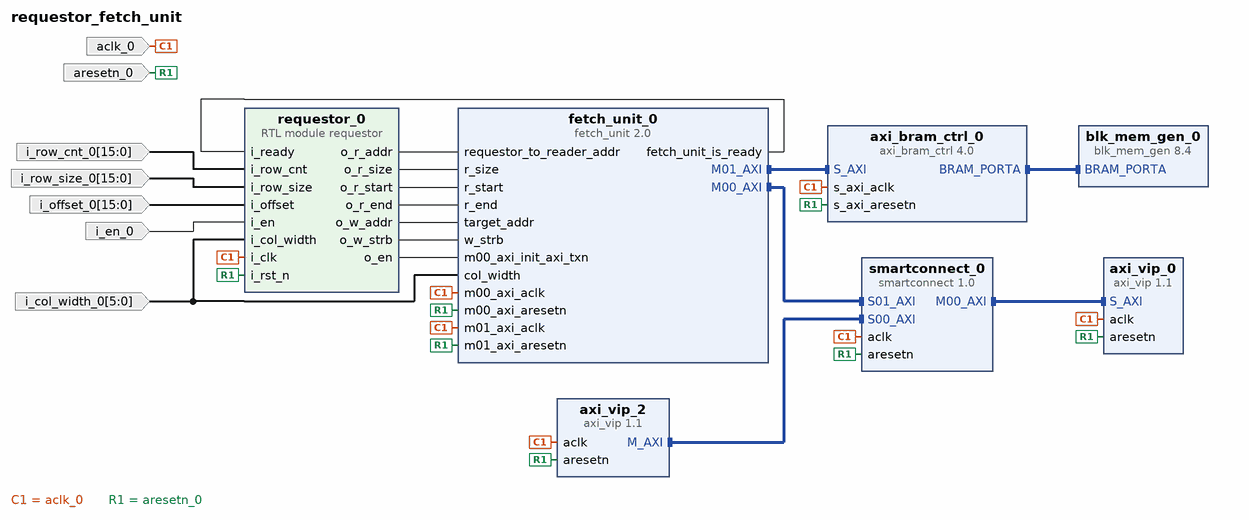
[diagram p0: block diagram of the top level]
# Vivado block design requestor_fetch_unit, xczu9eg-ffvb1156-2-e, Vivado 2017.4
create_bd_design requestor_fetch_unit

create_bd_port -dir I -type clk aclk_0
create_bd_port -dir I -type rst aresetn_0
create_bd_port -dir I -from 15 -to 0 i_row_cnt_0
create_bd_port -dir I -from 15 -to 0 i_row_size_0
create_bd_port -dir I -from 15 -to 0 i_offset_0
create_bd_port -dir I i_en_0
create_bd_port -dir I -from 5 -to 0 i_col_width_0

create_bd_cell -type ip -vlnv xilinx.com:ip:axi_vip:1.1 axi_vip_0
set_property -dict {CONFIG.INTERFACE_MODE SLAVE CONFIG.DATA_WIDTH 128} [get_bd_cells axi_vip_0]
create_bd_cell -type ip -vlnv xilinx.com:ip:axi_vip:1.1 axi_vip_2
set_property -dict [list \
  CONFIG.PROTOCOL AXI4 \
  CONFIG.READ_WRITE_MODE READ_WRITE \
  CONFIG.INTERFACE_MODE MASTER \
  CONFIG.ADDR_WIDTH 32 \
  CONFIG.DATA_WIDTH 128 \
  CONFIG.ID_WIDTH 0 \
  CONFIG.AWUSER_WIDTH 0 \
  CONFIG.ARUSER_WIDTH 0 \
  CONFIG.RUSER_WIDTH 0 \
  CONFIG.WUSER_WIDTH 0 \
  CONFIG.BUSER_WIDTH 0 \
  CONFIG.WUSER_BITS_PER_BYTE 0 \
  CONFIG.RUSER_BITS_PER_BYTE 0 \
  CONFIG.SUPPORTS_NARROW 1 \
  CONFIG.HAS_BURST 1 \
  CONFIG.HAS_LOCK 1 \
  CONFIG.HAS_CACHE 1 \
  CONFIG.HAS_REGION 1 \
  CONFIG.HAS_QOS 1 \
  CONFIG.HAS_PROT 1 \
  CONFIG.HAS_WSTRB 1 \
  CONFIG.HAS_BRESP 1 \
  CONFIG.HAS_RRESP 1 \
] [get_bd_cells axi_vip_2]
create_bd_cell -type ip -vlnv xilinx.com:ip:smartconnect:1.0 smartconnect_0
create_bd_cell -type ip -vlnv xilinx.com:ip:axi_bram_ctrl:4.0 axi_bram_ctrl_0
set_property -dict {CONFIG.DATA_WIDTH 128 CONFIG.SINGLE_PORT_BRAM 1} [get_bd_cells axi_bram_ctrl_0]
create_bd_cell -type ip -vlnv xilinx.com:ip:blk_mem_gen:8.4 blk_mem_gen_0
set_property -dict [list \
  CONFIG.Enable_32bit_Address true \
  CONFIG.Write_Width_A 128 \
  CONFIG.Read_Width_A 128 \
  CONFIG.Register_PortA_Output_of_Memory_Primitives false \
  CONFIG.Use_RSTA_Pin true \
  CONFIG.use_bram_block BRAM_Controller \
  CONFIG.EN_SAFETY_CKT true \
] [get_bd_cells blk_mem_gen_0]
create_bd_cell -type ip -vlnv user.org:user:fetch_unit:2.0 fetch_unit_0
set_property -dict {CONFIG.C_M01_AXI_BURST_LEN 1 CONFIG.C_M00_AXI_BURST_LEN 4 CONFIG.BUS_BIT 7} [get_bd_cells fetch_unit_0]
create_bd_cell -type module -reference requestor requestor_0

# ---- connections ----

connect_bd_intf_net [get_bd_intf_pins smartconnect_0/S00_AXI] [get_bd_intf_pins axi_vip_2/M_AXI]
connect_bd_intf_net [get_bd_intf_pins smartconnect_0/S01_AXI] [get_bd_intf_pins fetch_unit_0/M00_AXI]
connect_bd_intf_net [get_bd_intf_pins axi_vip_0/S_AXI] [get_bd_intf_pins smartconnect_0/M00_AXI]
connect_bd_intf_net [get_bd_intf_pins fetch_unit_0/M01_AXI] [get_bd_intf_pins axi_bram_ctrl_0/S_AXI]
connect_bd_intf_net [get_bd_intf_pins blk_mem_gen_0/BRAM_PORTA] [get_bd_intf_pins axi_bram_ctrl_0/BRAM_PORTA]
connect_bd_net [get_bd_pins requestor_0/o_r_addr] [get_bd_pins fetch_unit_0/requestor_to_reader_addr]
connect_bd_net [get_bd_pins requestor_0/o_r_size] [get_bd_pins fetch_unit_0/r_size]
connect_bd_net [get_bd_pins requestor_0/o_r_start] [get_bd_pins fetch_unit_0/r_start]
connect_bd_net [get_bd_pins requestor_0/o_r_end] [get_bd_pins fetch_unit_0/r_end]
connect_bd_net [get_bd_pins requestor_0/o_w_addr] [get_bd_pins fetch_unit_0/target_addr]
connect_bd_net -net aclk_0_1 [get_bd_ports aclk_0] \
  [get_bd_pins axi_vip_0/aclk] [get_bd_pins axi_vip_2/aclk] [get_bd_pins smartconnect_0/aclk] \
  [get_bd_pins axi_bram_ctrl_0/s_axi_aclk] [get_bd_pins fetch_unit_0/m01_axi_aclk] [get_bd_pins fetch_unit_0/m00_axi_aclk] \
  [get_bd_pins requestor_0/i_clk]
connect_bd_net -net aresetn_0_1 [get_bd_ports aresetn_0] \
  [get_bd_pins axi_vip_0/aresetn] [get_bd_pins axi_vip_2/aresetn] [get_bd_pins smartconnect_0/aresetn] \
  [get_bd_pins axi_bram_ctrl_0/s_axi_aresetn] [get_bd_pins fetch_unit_0/m01_axi_aresetn] \
  [get_bd_pins fetch_unit_0/m00_axi_aresetn] [get_bd_pins requestor_0/i_rst_n]
connect_bd_net -net i_row_cnt_0_1 [get_bd_ports i_row_cnt_0] [get_bd_pins requestor_0/i_row_cnt]
connect_bd_net -net i_row_size_0_1 [get_bd_ports i_row_size_0] [get_bd_pins requestor_0/i_row_size]
connect_bd_net -net i_offset_0_1 [get_bd_ports i_offset_0] [get_bd_pins requestor_0/i_offset]
connect_bd_net -net i_en_0_1 [get_bd_ports i_en_0] [get_bd_pins requestor_0/i_en]
connect_bd_net [get_bd_pins fetch_unit_0/fetch_unit_is_ready] [get_bd_pins requestor_0/i_ready]
connect_bd_net -net i_col_width_0_1 [get_bd_ports i_col_width_0] [get_bd_pins fetch_unit_0/col_width] [get_bd_pins requestor_0/i_col_width]
connect_bd_net [get_bd_pins requestor_0/o_w_strb] [get_bd_pins fetch_unit_0/w_strb]
connect_bd_net [get_bd_pins requestor_0/o_en] [get_bd_pins fetch_unit_0/m00_axi_init_axi_txn]

# ---- address map ----
assign_bd_address -offset 0x00000000 -range 64K -target_address_space [get_bd_addr_spaces axi_vip_2/Master_AXI] [get_bd_addr_segs axi_vip_0/S_AXI/Reg]
assign_bd_address -offset 0x00000000 -range 64K -target_address_space [get_bd_addr_spaces fetch_unit_0/M00_AXI] [get_bd_addr_segs axi_vip_0/S_AXI/Reg]
assign_bd_address -offset 0x00000000 -range 16K -target_address_space [get_bd_addr_spaces fetch_unit_0/M01_AXI] [get_bd_addr_segs axi_bram_ctrl_0/S_AXI/Mem0]

validate_bd_design
save_bd_design
